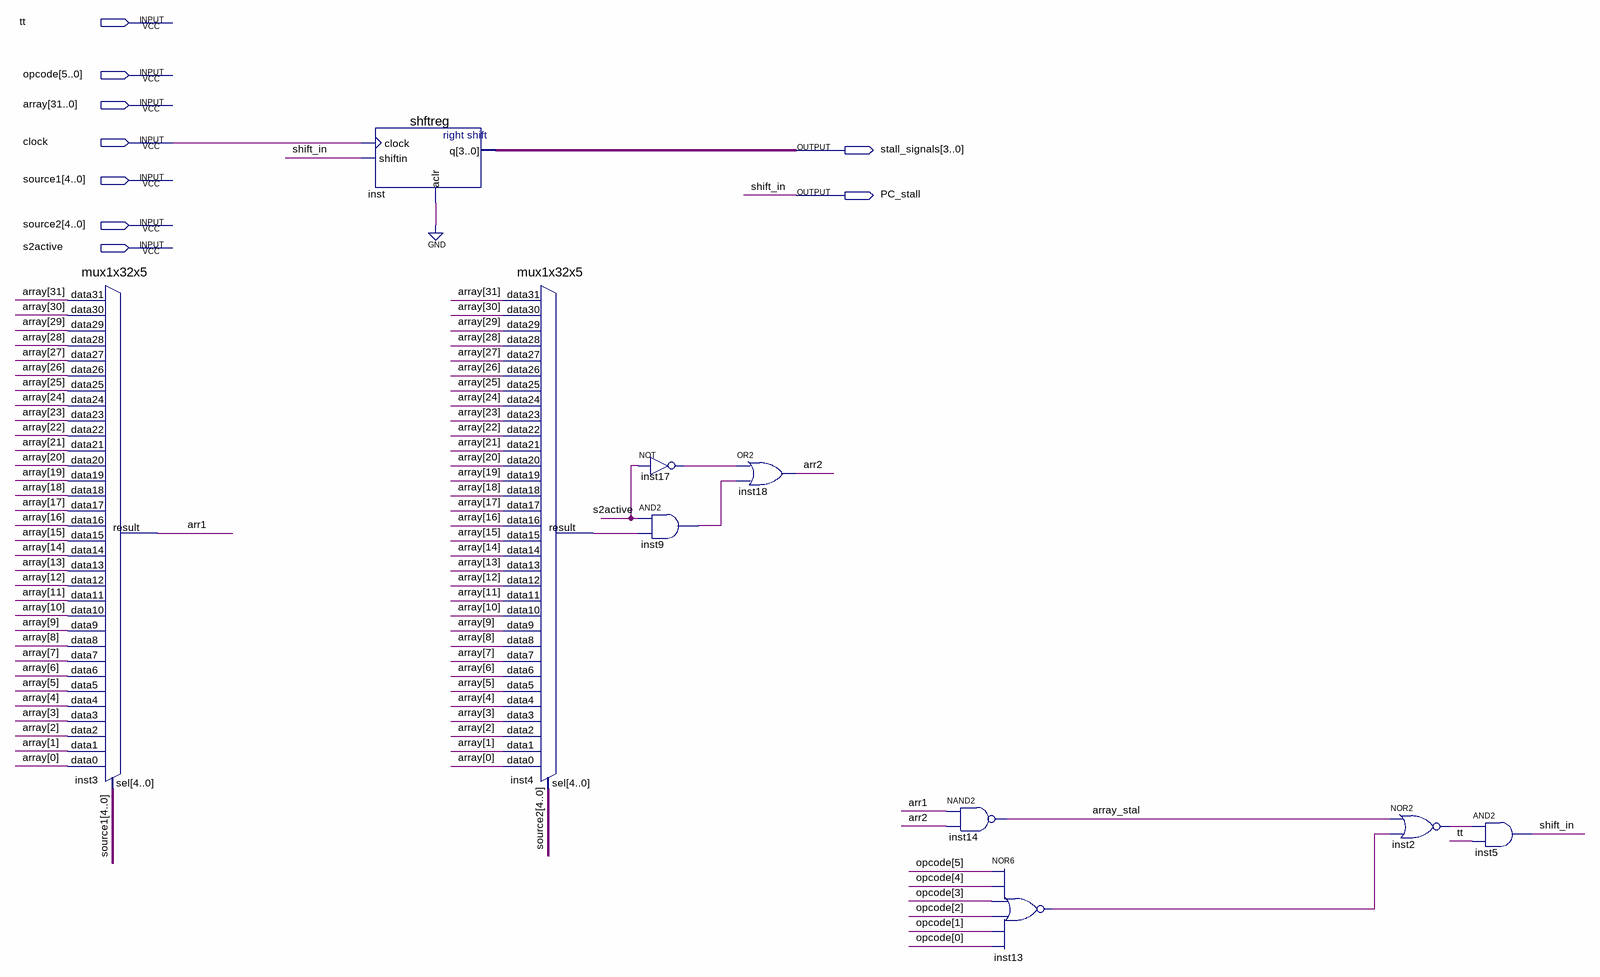
[diagram p0: schematic sheet]
// Quartus schematic Staller.bdf as structural Verilog: 10 symbols, 9 pins
module Staller (
  input  tt,
  input  [5:0] opcode,
  input  [31:0] array,
  input  clock,
  input  [4:0] source1,
  input  [4:0] source2,
  input  s2active,
  output [3:0] stall_signals,
  output PC_stall
);

  wire arr1, arr2, array_stal, inst2_out, inst4_result, inst9_out, inst13_out, inst17_out;

  mux1x32x5 inst3 (
    .data31(array[31]), .data30(array[30]), .data29(array[29]), .data28(array[28]), .data27(array[27]),
    .data26(array[26]), .data25(array[25]), .data24(array[24]), .data23(array[23]), .data22(array[22]),
    .data21(array[21]), .data20(array[20]), .data19(array[19]), .data18(array[18]), .data17(array[17]),
    .data16(array[16]), .data15(array[15]), .data14(array[14]), .data13(array[13]), .data12(array[12]),
    .data11(array[11]), .data10(array[10]), .data9(array[9]), .data8(array[8]), .data7(array[7]),
    .data6(array[6]), .data5(array[5]), .data4(array[4]), .data3(array[3]), .data2(array[2]),
    .data1(array[1]), .data0(array[0]), .sel(source1), .result(arr1));
  shftreg inst (.clock(clock), .shiftin(PC_stall), .aclr(1'b0), .q(stall_signals));
  mux1x32x5 inst4 (
    .data31(array[31]), .data30(array[30]), .data29(array[29]), .data28(array[28]), .data27(array[27]),
    .data26(array[26]), .data25(array[25]), .data24(array[24]), .data23(array[23]), .data22(array[22]),
    .data21(array[21]), .data20(array[20]), .data19(array[19]), .data18(array[18]), .data17(array[17]),
    .data16(array[16]), .data15(array[15]), .data14(array[14]), .data13(array[13]), .data12(array[12]),
    .data11(array[11]), .data10(array[10]), .data9(array[9]), .data8(array[8]), .data7(array[7]),
    .data6(array[6]), .data5(array[5]), .data4(array[4]), .data3(array[3]), .data2(array[2]),
    .data1(array[1]), .data0(array[0]), .sel(source2), .result(inst4_result));
  not inst17 (inst17_out, s2active);
  and inst9 (inst9_out, s2active, inst4_result);
  or inst18 (arr2, inst17_out, inst9_out);
  nand inst14 (array_stal, arr1, arr2);
  nor inst13 (inst13_out, opcode[5], opcode[4], opcode[3], opcode[2], opcode[1], opcode[0]);
  nor inst2 (inst2_out, array_stal, inst13_out);
  and inst5 (PC_stall, inst2_out, tt);

  // Other names for the same wires on the sheet: shift_in = PC_stall
endmodule
